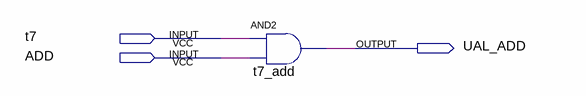
[diagram p0: schematic sheet]
// Quartus schematic ual_add.bdf as structural Verilog: 1 symbols, 3 pins
module ual_add (
  input  t7,
  input  ADD,
  output UAL_ADD
);

  and t7_add (UAL_ADD, t7, ADD);
endmodule
